# EAGLE design 103_button (EAGLE 7.6.0)
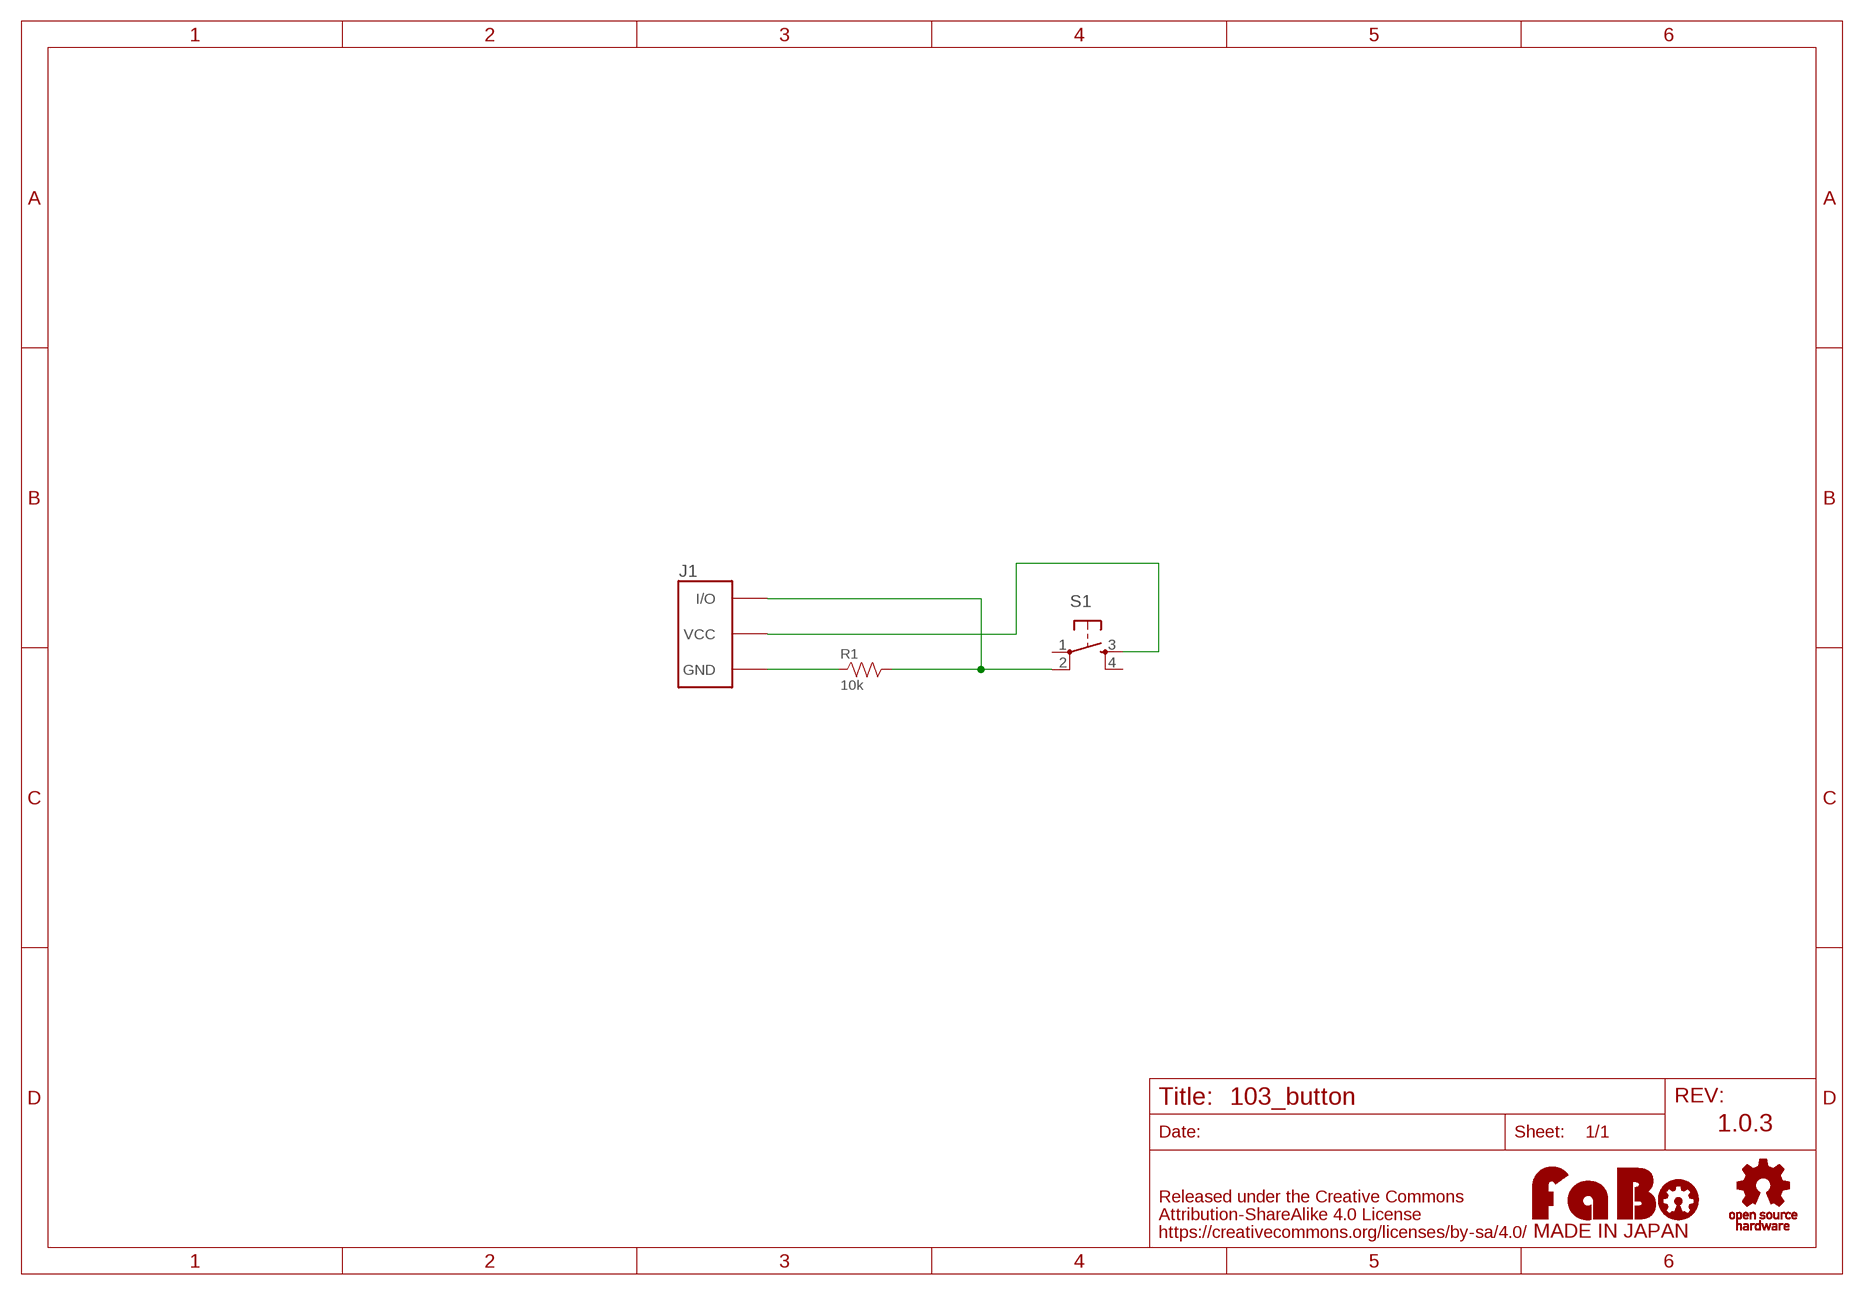
[diagram p0: schematic, sheet 1]

## Parts
J1  FABO_BRICK_3PIN  [FABO_BRICK_3PIN]
R1  10k  RESISTOR-AXL-REGULAR  [AXL-REGULAR]
S1  TACT-SWITCH-12MM  [1273HA-160G-G]
U$2  LOGO_OSHW-M_BOTTOM  [LOGO_OSHW_M_BOTTOM]
U$3  LOGO_FABO-M_BOTTOM  [LOGO_FABO_MS_BOTTOM]

## Nets
GND: J1.GND R1.1
N$1: J1.VCC S1.3
N$4: J1.I/O R1.2 S1.2
Unconnected: S1.1 S1.4

## Notes on the sheet
- 1.0.3

## Library data of the parts
J1 = FaBo-Template:FABO_BRICK_3PIN: FaBo Brick 3pin
R1 = FaBo-Resistors:RESISTOR: RESISTOR
S1 = FaBo-Switch:TACT-SWITCH
U$2 = FaBo-etc:LOGO_OSHW
U$3 = FaBo-etc:LOGO_FABO

## Board
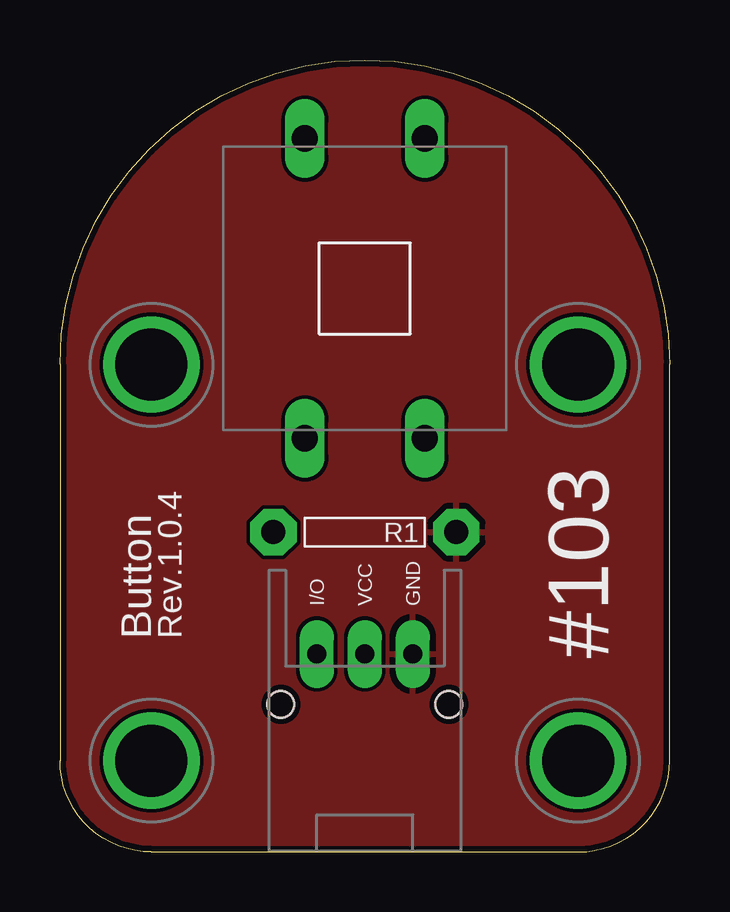
[diagram p1: board, top side]
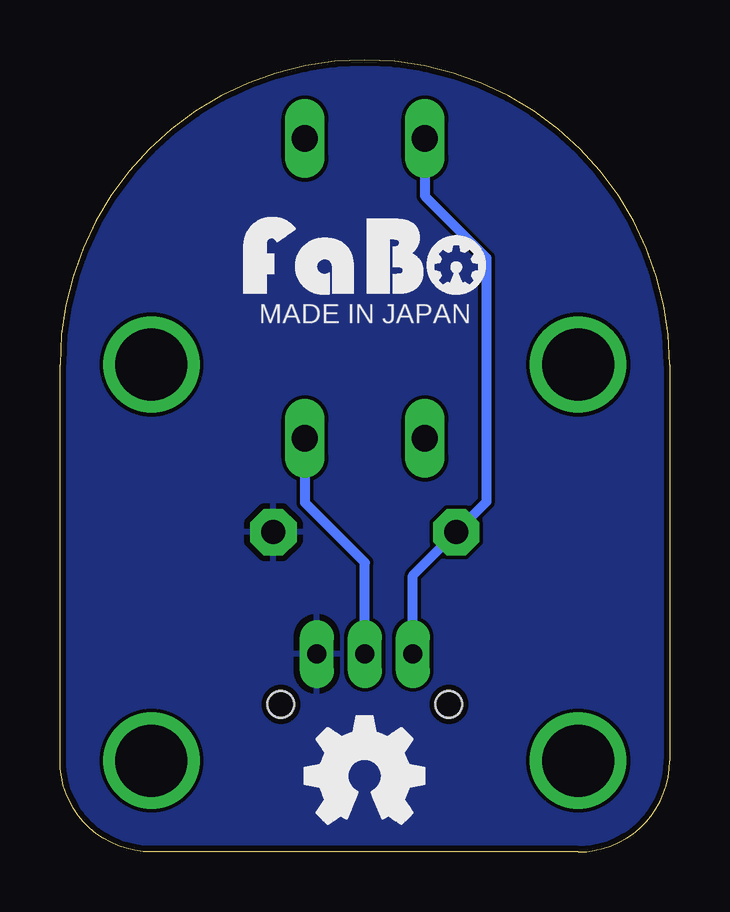
[diagram p2: board, bottom side, seen from below]

Size 25.4 x 33.02 mm. Coordinates in mm from the lower left corner, seen from the top.
Copper layers (1*16): Top 0.035mm / dielectric 1.5mm / Bottom 0.035mm
Design rules "SeeedStudio_2layer_DRU_no_angle_20140221": minimum track width 6mil, minimum drill 12mil, track to track 6mil, track to pad 6mil, pad to pad 6mil, via to via 6mil, smd to smd 0mil, copper to edge 10mil, drill to drill 10mil, minimum pad ring 10mil, minimum via ring 6mil, stop-mask expansion 2mil, vias tented up to drill 100mil, thermal gap 10mil

### Footprints (pad centres in the part's own frame; a part is rotated, then mirrored left to right if it is on the bottom)
FABO_BRICK_3PIN = drill 0.8 pad 1.422 long: GND 2,-8.255; I/O -2,-8.255; VCC 0,-8.255 | drill 3 pad 3.81: P$1 -8.89,3.81; P$2 8.89,3.81; P$3 -8.89,-12.7; P$4 8.89,-12.7 | hole 1.1: -3.5,-10.355; 3.5,-10.355
AXL-REGULAR = drill 1 pad 1.93 octagon: 1 -3.81,0; 2 3.81,0
1273HA-160G-G = drill 1.1 long: 1 -6.25,2.5; 2 6.25,2.5; 3 -6.25,-2.5; 4 6.25,-2.5

### Placement (x,y rotation side)
J1  12.7,16.51 0 top
R1  12.7,13.34 180 top
S1  12.7,23.5 90 top
U$2  12.7,3.17 0 top
U$3  12.7,22.86 0 top

### Tracks (layer width: path | path; a pad name or v marks a point on that pad's centre or on a via)
GND
  pour Bottom: 0,0 25.4,0 25.4,33.02 0,33.02
  pour Top: 0,0 25.4,0 25.4,33.02 0,33.02
N$1
  Bottom 0.406: J1.VCC 12.7,12.06 15.2,14.56 S1.3
N$4
  Bottom 0.406: J1.I/O 10.7,11.53 R1.2 7.62,14.61 7.62,24.77 10.2,27.34 S1.2

### Text on the board
tPlace: #103 | Button | Rev.1.0.4
bPlace: MADE IN JAPAN